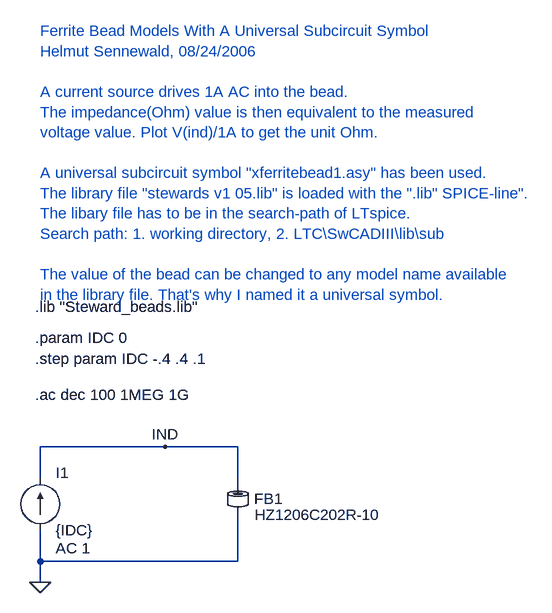
[diagram p0: schematic ferritebead_test2u.asc]
ferritebead_test2u.asc, the LTspice schematic file:
Version 4
SHEET 1 1144 680
WIRE 64 64 -128 64
WIRE 176 64 64 64
WIRE -128 112 -128 64
WIRE 176 112 176 64
WIRE -128 240 -128 192
WIRE 176 240 176 176
WIRE 176 240 -128 240
WIRE -128 272 -128 240
FLAG -128 272 0
FLAG 64 64 IND
SYMBOL current -128 192 M180
WINDOW 0 24 88 Left 0
WINDOW 3 24 0 Left 0
WINDOW 123 24 -28 Left 0
WINDOW 39 0 0 Left 0
SYMATTR InstName I1
SYMATTR Value {IDC}
SYMATTR Value2 AC 1
SYMBOL xferritebead1 176 144 R0
SYMATTR InstName FB1
SYMATTR Value HZ1206C202R-10
TEXT -136 -72 Left 0 !.step param IDC -.4 .4 .1
TEXT -136 -16 Left 0 !.ac dec 100 1MEG 1G
TEXT -136 -104 Left 0 !.param IDC 0
TEXT -128 -576 Left 0 ;Ferrite Bead Models With A Universal Subcircuit Symbol\nHelmut Sennewald, 08/24/2006\n \nA current source drives 1A AC into the bead.\nThe impedance(Ohm) value is then equivalent to the measured \nvoltage value. Plot V(ind)/1A to get the unit Ohm.\n \nA universal subcircuit symbol "xferritebead1.asy" has been used.\nThe library file "stewards v1 05.lib" is loaded with the ".lib" SPICE-line".\nThe libary file has to be in the search-path of LTspice. \nSearch path: 1. working directory, 2. LTC\\SwCADIII\\lib\\sub\n \nThe value of the bead can be changed to any model name available\nin the library file. That's why I named it a universal symbol.
TEXT -136 -152 Left 0 !.lib "Steward_beads.lib"

The netlist it stands for:
* ferritebead_test2u.asc
I1 0 IND {IDC} AC 1
XFB1 IND 0 HZ1206C202R-10  ; pins A B
.step param IDC -.4 .4 .1
.ac dec 100 1MEG 1G
.param IDC 0
* Ferrite Bead Models With A Universal Subcircuit Symbol
* Helmut Sennewald, 08/24/2006
* A current source drives 1A AC into the bead.
* The impedance(Ohm) value is then equivalent to the measured
* voltage value. Plot V(ind)/1A to get the unit Ohm.
* A universal subcircuit symbol "xferritebead1.asy" has been used.
* The library file "stewards v1 05.lib" is loaded with the ".lib" SPICE-line".
* The libary file has to be in the search-path of LTspice.
* Search path: 1. working directory, 2. LTC\SwCADIII\lib\sub
* The value of the bead can be changed to any model name available
* in the library file. That's why I named it a universal symbol.
.lib "Steward_beads.lib"
.backanno
.end